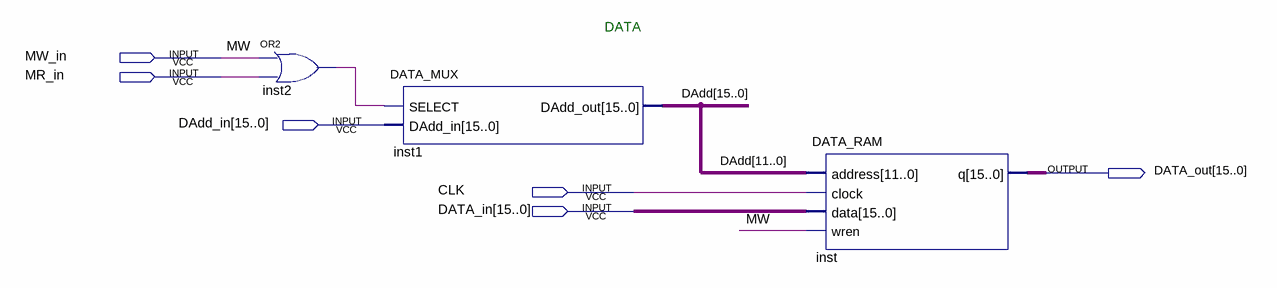
[diagram p0: schematic sheet]
// Quartus schematic DATA_BLOCK.bdf as structural Verilog: 3 symbols, 6 pins
module DATA_BLOCK (
  input  MW_in,
  input  MR_in,
  input  [15:0] DAdd_in,
  input  CLK,
  input  [15:0] DATA_in,
  output [15:0] DATA_out
);

  wire inst2_out;
  wire [15:0] DAdd;

  or inst2 (inst2_out, MW_in, MR_in);
  DATA_MUX inst1 (.SELECT(inst2_out), .DAdd_in(DAdd_in), .DAdd_out(DAdd));
  DATA_RAM inst (.address(DAdd[11:0]), .clock(CLK), .data(DATA_in), .wren(MW_in), .q(DATA_out));

  // Other names for the same wires on the sheet: MW = MW_in

  // Notes on the sheet:
  //   DATA
endmodule
